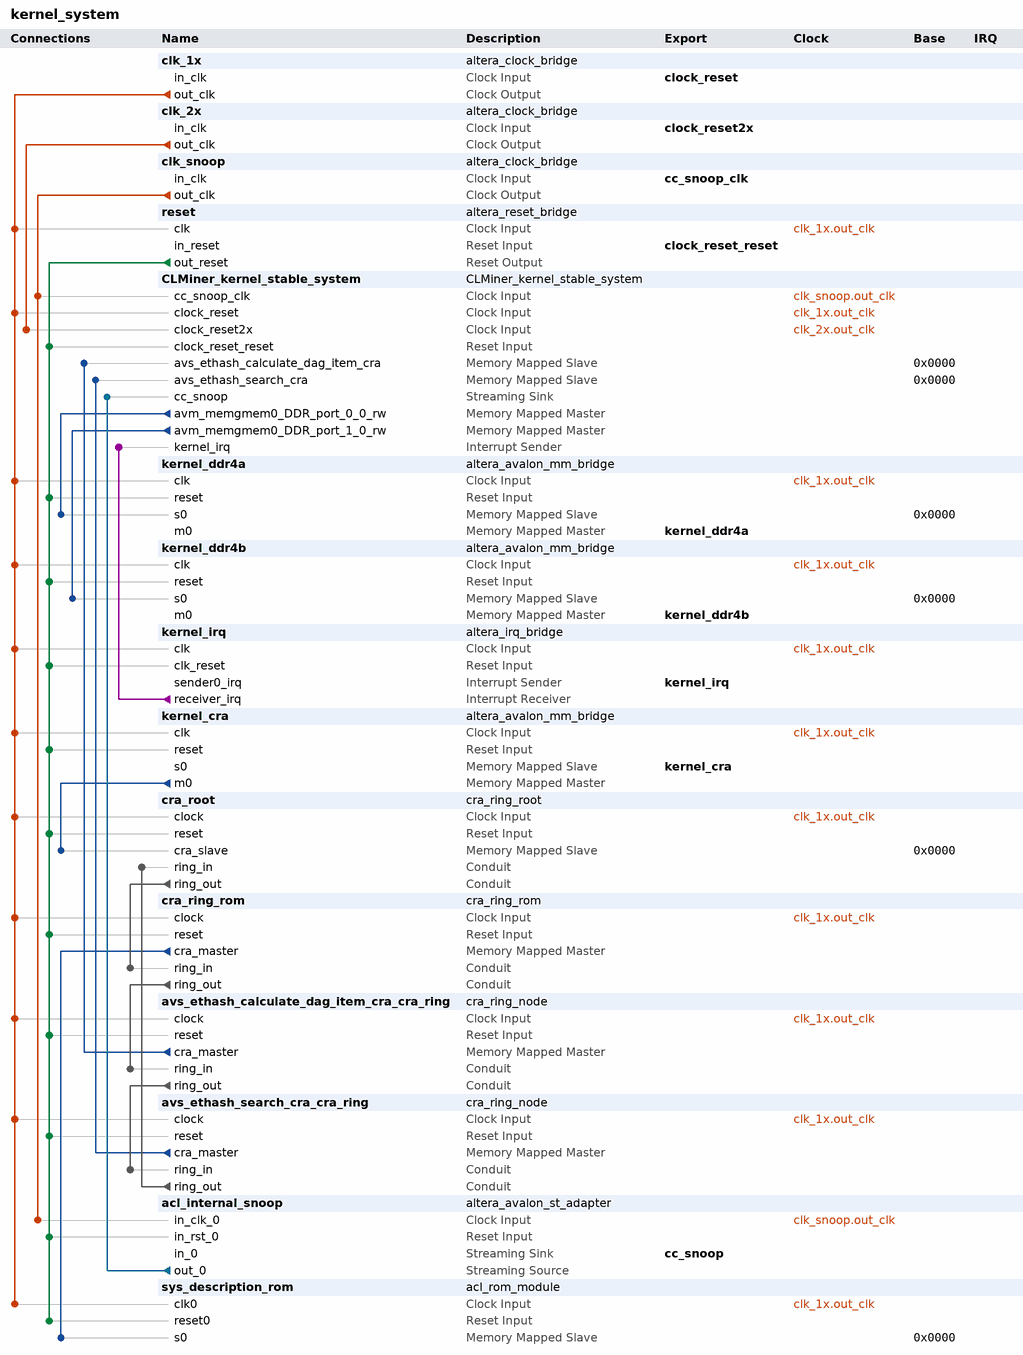
[diagram p0: system contents]
# Platform Designer (Qsys) system kernel_system, Arria 10 10AX115N2F40E2LG
# Parameters at their usual value, and those the tool derives, are not listed.
package require -exact qsys 1.0
create_system kernel_system
set_project_property DEVICE_FAMILY {Arria 10}
set_project_property DEVICE 10AX115N2F40E2LG

add_component clk_1x ip/kernel_system/kernel_system_clk_1x.ip altera_clock_bridge clk_1x 17.1
load_component clk_1x
set_component_parameter_value DERIVED_CLOCK_RATE 0
set_component_parameter_value EXPLICIT_CLOCK_RATE 0
save_component

add_component clk_2x ip/kernel_system/kernel_system_clk_2x.ip altera_clock_bridge clk_2x 17.1
load_component clk_2x
set_component_parameter_value DERIVED_CLOCK_RATE 0
set_component_parameter_value EXPLICIT_CLOCK_RATE 0
save_component

add_component clk_snoop ip/kernel_system/kernel_system_clk_snoop.ip altera_clock_bridge clk_snoop 17.1
load_component clk_snoop
set_component_parameter_value DERIVED_CLOCK_RATE 0
set_component_parameter_value EXPLICIT_CLOCK_RATE 0
save_component

add_component reset ip/kernel_system/kernel_system_reset.ip altera_reset_bridge reset 17.1
load_component reset
set_component_parameter_value ACTIVE_LOW_RESET 1
set_component_parameter_value SYNCHRONOUS_EDGES deassert
save_component

add_component CLMiner_kernel_stable_system ip/kernel_system/kernel_system_CLMiner_kernel_stable_system.ip CLMiner_kernel_stable_system CLMiner_kernel_stable_system 14.0

add_component kernel_ddr4a ip/kernel_system/kernel_system_kernel_ddr4a.ip altera_avalon_mm_bridge kernel_ddr4a 17.1
load_component kernel_ddr4a
set_component_parameter_value DATA_WIDTH 512
set_component_parameter_value ADDRESS_WIDTH 32
set_component_parameter_value USE_AUTO_ADDRESS_WIDTH 0
set_component_parameter_value ADDRESS_UNITS SYMBOLS
set_component_parameter_value MAX_BURST_SIZE 16
set_component_parameter_value MAX_PENDING_RESPONSES 64
save_component

add_component kernel_ddr4b ip/kernel_system/kernel_system_kernel_ddr4b.ip altera_avalon_mm_bridge kernel_ddr4b 17.1
load_component kernel_ddr4b
set_component_parameter_value DATA_WIDTH 512
set_component_parameter_value ADDRESS_WIDTH 32
set_component_parameter_value USE_AUTO_ADDRESS_WIDTH 0
set_component_parameter_value ADDRESS_UNITS SYMBOLS
set_component_parameter_value MAX_BURST_SIZE 16
set_component_parameter_value MAX_PENDING_RESPONSES 64
save_component

add_component kernel_irq ip/kernel_system/kernel_system_kernel_irq.ip altera_irq_bridge kernel_irq 17.1
load_component kernel_irq
set_component_parameter_value IRQ_WIDTH 1
save_component

add_component kernel_cra ip/kernel_system/kernel_system_kernel_cra.ip altera_avalon_mm_bridge kernel_cra 17.1
load_component kernel_cra
set_component_parameter_value DATA_WIDTH 64
set_component_parameter_value ADDRESS_WIDTH 30
set_component_parameter_value USE_AUTO_ADDRESS_WIDTH 0
set_component_parameter_value ADDRESS_UNITS SYMBOLS
set_component_parameter_value MAX_PENDING_RESPONSES 1
set_component_parameter_value PIPELINE_COMMAND 0
set_component_parameter_value PIPELINE_RESPONSE 0
save_component

add_component cra_root ip/kernel_system/kernel_system_cra_root.ip cra_ring_root cra_root 1.0
load_component cra_root
set_component_parameter_value ASYNC_RESET 1
set_component_parameter_value SYNCHRONIZE_RESET 0
set_component_parameter_value ADDR_W 5
set_component_parameter_value DATA_W 64
set_component_parameter_value ID_W 1
set_component_parameter_value ROM_EXT_W 0
set_component_parameter_value ROM_ENABLE 1
save_component

add_component cra_ring_rom ip/kernel_system/kernel_system_cra_ring_rom.ip cra_ring_rom cra_ring_rom 1.0
load_component cra_ring_rom
set_component_parameter_value ASYNC_RESET 1
set_component_parameter_value SYNCHRONIZE_RESET 0
set_component_parameter_value RING_ADDR_W 5
set_component_parameter_value DATA_W 64
set_component_parameter_value ID_W 1
set_component_parameter_value ROM_W 5
set_component_parameter_value ROM_EXT_W 0
save_component

add_component avs_ethash_calculate_dag_item_cra_cra_ring ip/kernel_system/kernel_system_avs_ethash_calculate_dag_item_cra_cra_ring.ip cra_ring_node avs_ethash_calculate_dag_item_cra_cra_ring 1.0
load_component avs_ethash_calculate_dag_item_cra_cra_ring
set_component_parameter_value ASYNC_RESET 1
set_component_parameter_value SYNCHRONIZE_RESET 0
set_component_parameter_value RING_ADDR_W 5
set_component_parameter_value CRA_ADDR_W 4
set_component_parameter_value DATA_W 64
set_component_parameter_value ID_W 1
set_component_parameter_value ID 0
save_component

add_component avs_ethash_search_cra_cra_ring ip/kernel_system/kernel_system_avs_ethash_search_cra_cra_ring.ip cra_ring_node avs_ethash_search_cra_cra_ring 1.0
load_component avs_ethash_search_cra_cra_ring
set_component_parameter_value ASYNC_RESET 1
set_component_parameter_value SYNCHRONIZE_RESET 0
set_component_parameter_value RING_ADDR_W 5
set_component_parameter_value CRA_ADDR_W 5
set_component_parameter_value DATA_W 64
set_component_parameter_value ID_W 1
set_component_parameter_value ID 1
save_component

add_component acl_internal_snoop ip/kernel_system/kernel_system_acl_internal_snoop.ip altera_avalon_st_adapter acl_internal_snoop 17.1
load_component acl_internal_snoop
set_component_parameter_value inBitsPerSymbol 33
set_component_parameter_value inUsePackets 0
set_component_parameter_value inDataWidth 33
set_component_parameter_value inMaxChannel 0
set_component_parameter_value inChannelWidth 0
set_component_parameter_value inErrorWidth 0
set_component_parameter_value inUseEmptyPort 0
set_component_parameter_value inEmptyWidth 1
set_component_parameter_value inUseValid 1
set_component_parameter_value inUseReady 1
set_component_parameter_value inReadyLatency 0
set_component_parameter_value outDataWidth 33
set_component_parameter_value outMaxChannel 0
set_component_parameter_value outChannelWidth 0
set_component_parameter_value outErrorWidth 0
set_component_parameter_value outUseEmptyPort 0
set_component_parameter_value outEmptyWidth 1
set_component_parameter_value outUseValid 1
set_component_parameter_value outUseReady 1
set_component_parameter_value outReadyLatency 0
save_component

add_component sys_description_rom ip/kernel_system/kernel_system_sys_description_rom.ip acl_rom_module sys_description_rom 1.0
load_component sys_description_rom
set_component_parameter_value ASYNC_RESET 1
set_component_parameter_value SYNCHRONIZE_RESET 0
set_component_parameter_value INIT_FILE sys_description.hex
set_component_parameter_value ADDRESS_WIDTH 5
set_component_parameter_value DATA_WIDTH 64
set_component_parameter_value FAMILY {Arria 10}
save_component

# connections
add_connection clk_1x.out_clk avs_ethash_calculate_dag_item_cra_cra_ring.clock clock
add_connection clk_1x.out_clk avs_ethash_search_cra_cra_ring.clock clock
add_connection clk_1x.out_clk CLMiner_kernel_stable_system.clock_reset clock
add_connection clk_1x.out_clk cra_ring_rom.clock clock
add_connection clk_1x.out_clk cra_root.clock clock
add_connection clk_1x.out_clk kernel_cra.clk clock
add_connection clk_1x.out_clk kernel_ddr4a.clk clock
add_connection clk_1x.out_clk kernel_ddr4b.clk clock
add_connection clk_1x.out_clk kernel_irq.clk clock
add_connection clk_1x.out_clk reset.clk clock
add_connection clk_1x.out_clk sys_description_rom.clk0 clock
add_connection clk_2x.out_clk CLMiner_kernel_stable_system.clock_reset2x clock
add_connection clk_snoop.out_clk acl_internal_snoop.in_clk_0 clock
add_connection clk_snoop.out_clk CLMiner_kernel_stable_system.cc_snoop_clk clock
add_connection reset.out_reset acl_internal_snoop.in_rst_0 reset
add_connection reset.out_reset avs_ethash_calculate_dag_item_cra_cra_ring.reset reset
add_connection reset.out_reset avs_ethash_search_cra_cra_ring.reset reset
add_connection reset.out_reset CLMiner_kernel_stable_system.clock_reset_reset reset
add_connection reset.out_reset cra_ring_rom.reset reset
add_connection reset.out_reset cra_root.reset reset
add_connection reset.out_reset kernel_cra.reset reset
add_connection reset.out_reset kernel_ddr4a.reset reset
add_connection reset.out_reset kernel_ddr4b.reset reset
add_connection reset.out_reset kernel_irq.clk_reset reset
add_connection reset.out_reset sys_description_rom.reset0 reset
add_connection avs_ethash_calculate_dag_item_cra_cra_ring.cra_master CLMiner_kernel_stable_system.avs_ethash_calculate_dag_item_cra avalon
set_connection_parameter_value avs_ethash_calculate_dag_item_cra_cra_ring.cra_master/CLMiner_kernel_stable_system.avs_ethash_calculate_dag_item_cra baseAddress 0x0000
add_connection avs_ethash_search_cra_cra_ring.cra_master CLMiner_kernel_stable_system.avs_ethash_search_cra avalon
set_connection_parameter_value avs_ethash_search_cra_cra_ring.cra_master/CLMiner_kernel_stable_system.avs_ethash_search_cra baseAddress 0x0000
add_connection CLMiner_kernel_stable_system.avm_memgmem0_DDR_port_0_0_rw kernel_ddr4a.s0 avalon
set_connection_parameter_value CLMiner_kernel_stable_system.avm_memgmem0_DDR_port_0_0_rw/kernel_ddr4a.s0 baseAddress 0x0000
add_connection CLMiner_kernel_stable_system.avm_memgmem0_DDR_port_1_0_rw kernel_ddr4b.s0 avalon
set_connection_parameter_value CLMiner_kernel_stable_system.avm_memgmem0_DDR_port_1_0_rw/kernel_ddr4b.s0 baseAddress 0x0000
add_connection cra_ring_rom.cra_master sys_description_rom.s0 avalon
set_connection_parameter_value cra_ring_rom.cra_master/sys_description_rom.s0 baseAddress 0x0000
add_connection kernel_cra.m0 cra_root.cra_slave avalon
set_connection_parameter_value kernel_cra.m0/cra_root.cra_slave baseAddress 0x0000
add_connection acl_internal_snoop.out_0 CLMiner_kernel_stable_system.cc_snoop avalon_streaming
add_connection avs_ethash_calculate_dag_item_cra_cra_ring.ring_out avs_ethash_search_cra_cra_ring.ring_in conduit
add_connection avs_ethash_search_cra_cra_ring.ring_out cra_root.ring_in conduit
add_connection cra_ring_rom.ring_out avs_ethash_calculate_dag_item_cra_cra_ring.ring_in conduit
add_connection cra_root.ring_out cra_ring_rom.ring_in conduit
add_connection kernel_irq.receiver_irq CLMiner_kernel_stable_system.kernel_irq interrupt

# exported interfaces
add_interface cc_snoop avalon_streaming sink
set_interface_property cc_snoop EXPORT_OF acl_internal_snoop.in_0
add_interface cc_snoop_clk clock sink
set_interface_property cc_snoop_clk EXPORT_OF clk_snoop.in_clk
add_interface clock_reset clock sink
set_interface_property clock_reset EXPORT_OF clk_1x.in_clk
add_interface clock_reset2x clock sink
set_interface_property clock_reset2x EXPORT_OF clk_2x.in_clk
add_interface clock_reset_reset reset sink
set_interface_property clock_reset_reset EXPORT_OF reset.in_reset
add_interface kernel_cra avalon slave
set_interface_property kernel_cra EXPORT_OF kernel_cra.s0
add_interface kernel_ddr4a avalon master
set_interface_property kernel_ddr4a EXPORT_OF kernel_ddr4a.m0
add_interface kernel_ddr4b avalon master
set_interface_property kernel_ddr4b EXPORT_OF kernel_ddr4b.m0
add_interface kernel_irq interrupt sender
set_interface_property kernel_irq EXPORT_OF kernel_irq.sender0_irq

set_interconnect_requirement {$system} qsys_mm.clockCrossingAdapter HANDSHAKE
set_interconnect_requirement {$system} qsys_mm.maxAdditionalLatency 0

save_system kernel_system.qsys
